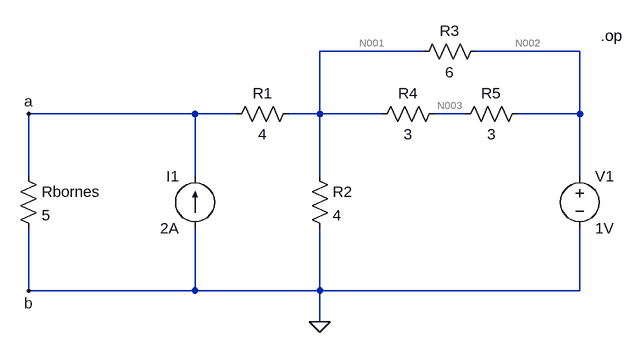
[diagram p0: schematic circuit+res.asc]
circuit+res.asc, the LTspice schematic file:
Version 4
SHEET 1 880 680
WIRE 416 16 256 16
WIRE 656 16 496 16
WIRE 64 112 -192 112
WIRE 128 112 64 112
WIRE 256 112 256 16
WIRE 256 112 208 112
WIRE 352 112 256 112
WIRE 480 112 432 112
WIRE 656 112 656 16
WIRE 656 112 560 112
WIRE -192 208 -192 112
WIRE 64 208 64 112
WIRE 256 208 256 112
WIRE 656 208 656 112
WIRE -192 384 -192 288
WIRE 64 384 64 288
WIRE 64 384 -192 384
WIRE 256 384 256 288
WIRE 256 384 64 384
WIRE 656 384 656 288
WIRE 656 384 256 384
WIRE 256 432 256 384
FLAG -192 112 a
FLAG -192 384 b
FLAG 256 432 0
SYMBOL voltage 656 192 R0
WINDOW 123 0 0 Left 0
WINDOW 39 0 0 Left 0
SYMATTR InstName V1
SYMATTR Value 1V
SYMBOL current 64 288 R180
WINDOW 0 24 80 Left 2
WINDOW 3 24 0 Left 2
SYMATTR InstName I1
SYMATTR Value 2A
SYMBOL res 448 96 R90
WINDOW 0 0 56 VBottom 2
WINDOW 3 32 56 VTop 2
SYMATTR InstName R4
SYMATTR Value 3
SYMBOL res 576 96 R90
WINDOW 0 0 56 VBottom 2
WINDOW 3 32 56 VTop 2
SYMATTR InstName R5
SYMATTR Value 3
SYMBOL res 224 96 R90
WINDOW 0 0 56 VBottom 2
WINDOW 3 32 56 VTop 2
SYMATTR InstName R1
SYMATTR Value 4
SYMBOL res 512 0 R90
WINDOW 0 0 56 VBottom 2
WINDOW 3 32 56 VTop 2
SYMATTR InstName R3
SYMATTR Value 6
SYMBOL res 240 192 R0
SYMATTR InstName R2
SYMATTR Value 4
SYMBOL res -208 192 R0
SYMATTR InstName Rbornes
SYMATTR Value 5
TEXT 688 -8 Left 2 !.op

The netlist it stands for:
* circuit+res.asc
V1 N002 0 1V
I1 0 a 2A
R4 N003 N001 3
R5 N002 N003 3
R1 N001 a 4
R3 N002 N001 6
R2 N001 0 4
Rbornes a 0 5
.op
.backanno
.end

* Results of the author's LTspice run, read from the files saved beside the schematic
* Operating Point:
*   V(n002) = 1 V
*   V(a) = 5.6 V
*   V(n003) = 1.54 V
*   V(n001) = 2.08 V
*   I(I1) = 2 A
*   I(Rbornes) = 1.12 A
*   I(R2) = 520 mA
*   I(R3) = -180 mA
*   I(R1) = -880 mA
*   I(R5) = -180 mA
*   I(R4) = -180 mA
*   I(V1) = 360 mA